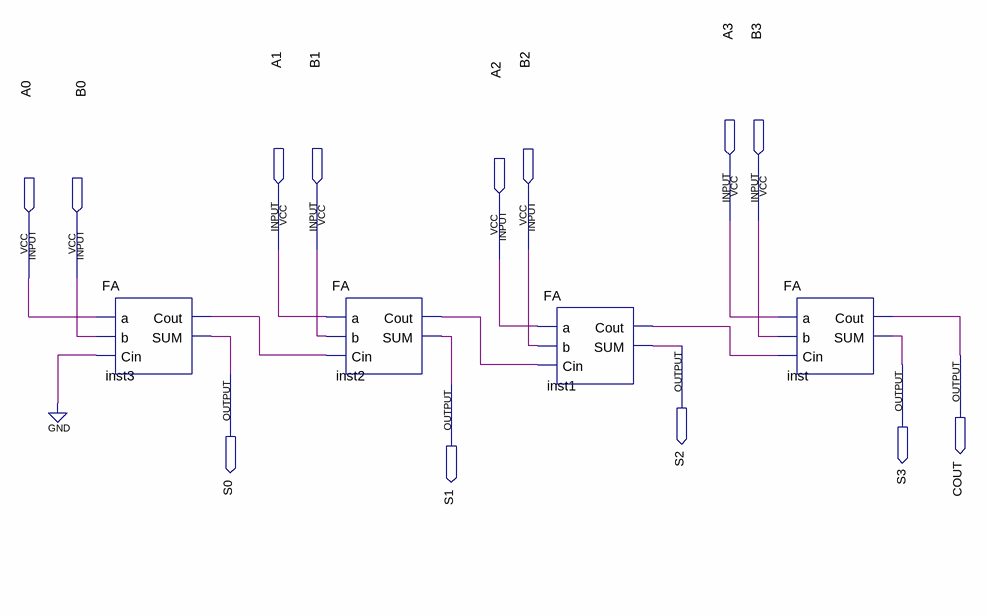
[diagram p0: schematic sheet]
// Quartus schematic CA.bdf as structural Verilog: 4 symbols, 13 pins
module CA (
  input  A3,
  input  B3,
  input  A1,
  input  B1,
  input  B2,
  input  A2,
  input  A0,
  input  B0,
  output S2,
  output COUT,
  output S3,
  output S0,
  output S1
);

  wire inst1_cout, inst2_cout, inst3_cout;

  FA inst3 (.a(A0), .b(B0), .Cin(1'b0), .Cout(inst3_cout), .SUM(S0));
  FA inst2 (.a(A1), .b(B1), .Cin(inst3_cout), .Cout(inst2_cout), .SUM(S1));
  FA inst1 (.a(A2), .b(B2), .Cin(inst2_cout), .Cout(inst1_cout), .SUM(S2));
  FA inst (.a(A3), .b(B3), .Cin(inst1_cout), .Cout(COUT), .SUM(S3));
endmodule
